# Altium project Odrive_M.PrjPcb (part 2 of 2)

## Sheet DRV8301_Power.SchDoc
size A3; SheetNumber: 2; SheetTotal: 4
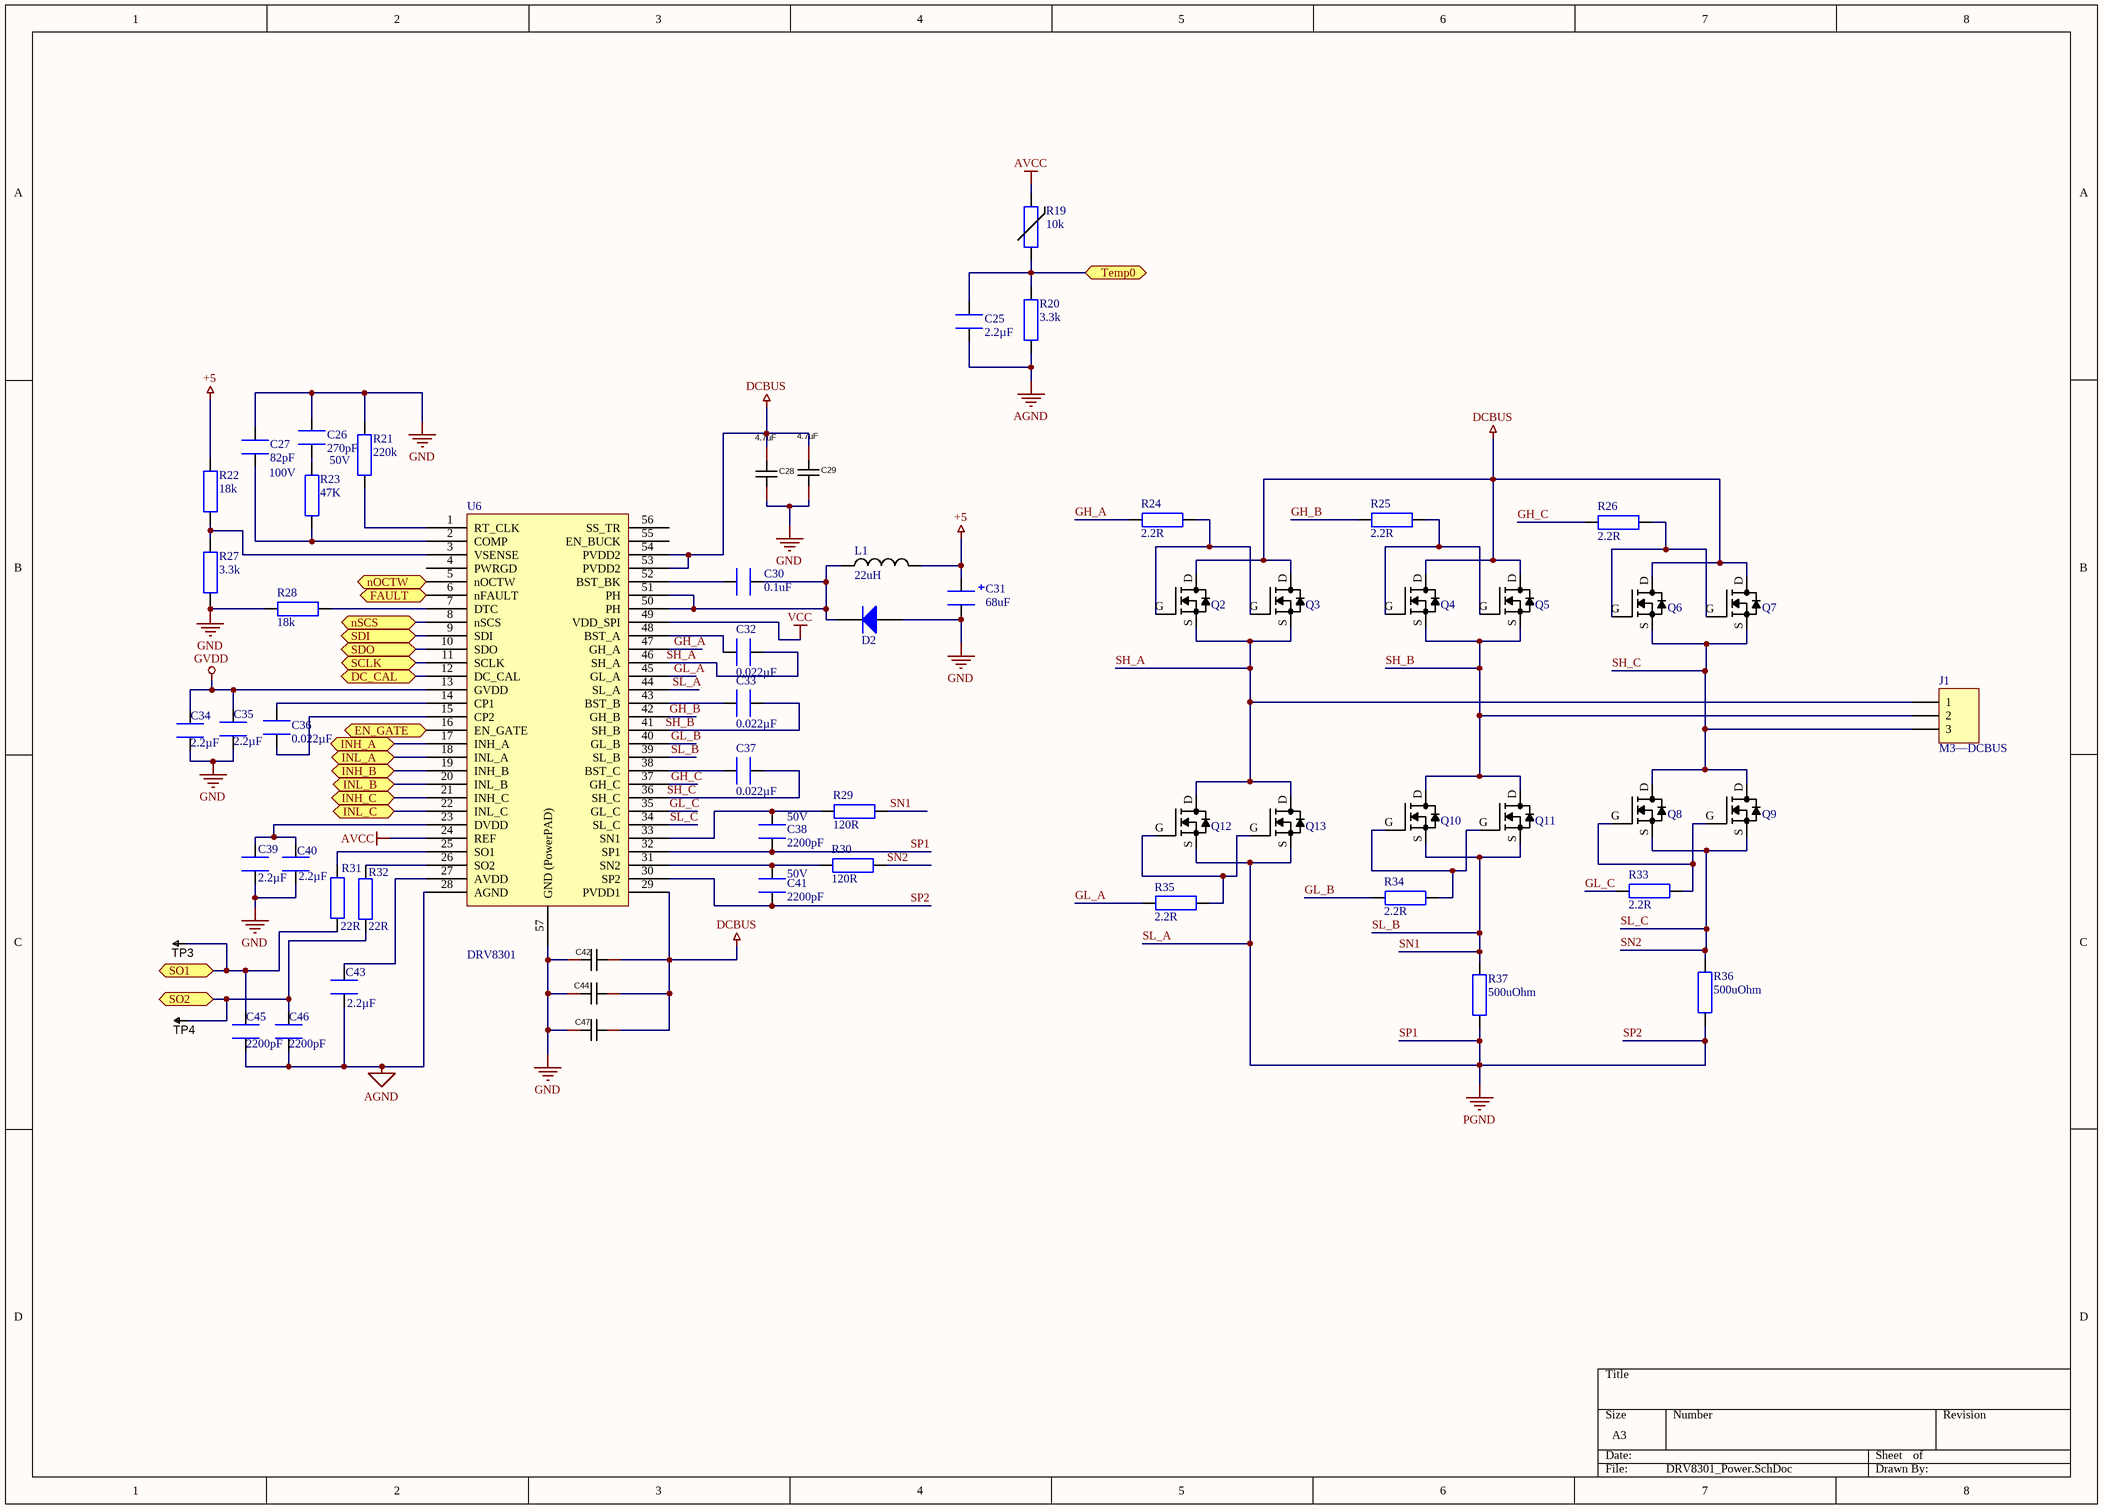
[diagram p2: DRV8301_Power.SchDoc]

### Parts
C25  2.2µF  [CAPC1608X09L]
C26  270pF  Voltage - Rated: 50V  [CAPC1608X09L]
C27  82pF  Voltage - Rated: 100V  [CAPC1608X09L]
C28  4.7uF  [C1210]
C29  4.7uF  [C1210]
C30  0.1uF  [CAPC1608X09L]
C31  68uF  [CAPCP6032X28N]
C32  0.022µF  [CAPC1608X09L]
C33  0.022µF  [CAPC1608X09L]
C34  2.2µF  [CAPC1608X09L]
C35  2.2µF  [CAPC1608X09L]
C36  0.022µF  [CAPC1608X09L]
C37  0.022µF  [CAPC1608X09L]
C38  2200pF  Voltage - Rated: 50V  [CAPC1608X09L]
C39  2.2µF  [CAPC1608X09L]
C40  2.2µF  [CAPC1608X09L]
C41  2200pF  Voltage - Rated: 50V  [CAPC1608X09L]
C42  4.7uF  [C1210]  (value not drawn)
C43  2.2µF  [CAPC1608X09L]
C44  4.7uF  [C1210]  (value not drawn)
C45  2200pF  [CAPC1608X09L]
C46  2200pF  [CAPC1608X09L]
C47  4.7uF  [C1210]  (value not drawn)
D2  MBR140SFT1G  [DIOM2717X10N]  (value not drawn)
J1  M3—DCBUS  [CONN-TH_MR30-M]
L1  22uH  [INDC6060X28N]
Q2  NTMFS5C628NLT  [SO8FL]  (value not drawn)
Q3  NTMFS5C628NLT  [SO8FL]  (value not drawn)
Q4  NTMFS5C628NLT  [SO8FL]  (value not drawn)
Q5  NTMFS5C628NLT  [SO8FL]  (value not drawn)
Q6  NTMFS5C628NLT  [SO8FL]  (value not drawn)
Q7  NTMFS5C628NLT  [SO8FL]  (value not drawn)
Q8  NTMFS5C628NLT  [SO8FL]  (value not drawn)
Q9  NTMFS5C628NLT  [SO8FL]  (value not drawn)
Q10  NTMFS5C628NLT  [SO8FL]  (value not drawn)
Q11  NTMFS5C628NLT  [SO8FL]  (value not drawn)
Q12  NTMFS5C628NLT  [SO8FL]  (value not drawn)
Q13  NTMFS5C628NLT  [SO8FL]  (value not drawn)
R19  value 10k  [RESC1005X40N]  (hidden comment: NCP15XH103F03RC)
R20  3.3k  [RESC1608X55N]
R21  220k  [RESC1608X55N]
R22  18k  [0603_R]
R23  47K  [RESC1608X55N]
R24  2.2R  [RESC1608X55N]
R25  2.2R  [RESC1608X55N]
R26  2.2R  [RESC1608X55N]
R27  3.3k  [0603_R]
R28  18k  [0603_R]
R29  120R  [RESC1608X55N]
R30  120R  [RESC1608X55N]
R31  22R  [RESC1608X55N]
R32  22R  [RESC1608X55N]
R33  2.2R  [RESC1608X55N]
R34  2.2R  [RESC1608X55N]
R35  2.2R  [RESC1608X55N]
R36  value 500uOhm  [RESC6432X09N]  (hidden comment: CSR2512C0R0005F)
R37  value 500uOhm  [RESC6432X09N]  (hidden comment: CSR2512C0R0005F)
TP3  TESTPOINT  [TP-R30]  (value not drawn)  (no BOM)
TP4  TESTPOINT  [TP-R30]  (value not drawn)  (no BOM)
U6  DRV8301  [TSSOP50P810X120_HS-57N]

### Ports
DC_CAL (bidir), EN_GATE (bidir), FAULT (bidir), INH_A (bidir), INH_B (bidir), INH_C (bidir), INL_A (bidir), INL_B (bidir), INL_C (bidir), nOCTW (bidir), nSCS (bidir), SCLK (bidir), SDI (bidir), SDO (bidir), SO1 (bidir), SO2 (bidir), Temp0 (bidir)

### Nets
+5: C31.1 L1.2 R22.2
AGND: C25.1 C26.2 C27.2 C28.1 C29.1 C31.2 C34.1 C35.1 C39.2 C40.2 C42.1 C43.1 C44.1 C45.1 C46.1 C47.1 D2.A R20.1 R21.2 R27.1 R28.2 U6.28(AGND) U6.57(GND_(PowerPAD))  [also labelled GND]
AVCC: R19.2 U6.24(REF)
DCBUS: C28.2 C29.2 C42.2 C44.2 C47.2 Q2.D Q3.D Q4.D Q5.D Q6.D Q7.D U6.29(PVDD1) U6.53(PVDD2) U6.54(PVDD2)
GVDD: C34.2 C35.2 U6.13(GVDD)
PGND: C38.1 C41.1 Q12.S Q13.S R36.1 R37.1 U6.30(SP2) U6.32(SP1) U6.44(SL_A)  [also labelled SL_A, SP1, SP2]
VCC: U6.49(VDD_SPI)
EN_GATE: U6.16(EN_GATE) ; port EN_GATE
FAULT: U6.6(nFAULT) ; port FAULT
GH_A: R24.2 U6.47(GH_A)  [project net GH_A_2]
GH_B: R25.2 U6.42(GH_B)  [project net GH_B_2]
GH_C: R26.2 U6.37(GH_C)  [project net GH_C_2]
GL_A: R35.2 U6.45(GL_A)  [project net GL_A_2]
GL_B: R34.2 U6.40(GL_B)  [project net GL_B_2]
GL_C: R33.2 U6.35(GL_C)  [project net GL_C_2]
M0_AH: U6.17(INH_A) ; port INH_A
M0_AL: U6.18(INL_A) ; port INL_A
M0_BH: U6.19(INH_B) ; port INH_B
M0_BL: U6.20(INL_B) ; port INL_B
M0_CH: U6.21(INH_C) ; port INH_C
M0_CL: U6.22(INL_C) ; port INL_C
M0_nCS: U6.8(nSCS) ; port nSCS
M0_SO1: C45.2 R31.2 TP3.1 ; port SO1
M0_SO2: C46.2 R32.2 TP4.1 ; port SO2
M0_TEMP: C25.2 R19.1 R20.2 ; port Temp0
OCTW: U6.5(nOCTW) ; port nOCTW
SH_A: C32.1 J1.1 Q2.S Q3.S Q12.D Q13.D U6.46(SH_A)  [project net SH_A_2]
SH_B: C33.1 J1.2 Q4.S Q5.S Q10.D Q11.D U6.41(SH_B)  [project net SH_B_2]
SH_C: C37.1 J1.3 Q6.S Q7.S Q8.D Q9.D U6.36(SH_C)  [project net SH_C_2]
SL_B: Q10.S Q11.S R29.1 R37.2 U6.39(SL_B)  [also labelled SN1]  [project net SL_B_2]
SL_C: Q8.S Q9.S R30.1 R36.2 U6.34(SL_C)  [also labelled SN2]  [project net SL_C_2]
SPI_MISO: U6.9(SDI) ; port SDI
SPI_MOSI: U6.10(SDO) ; port SDO
SPI_SCK: U6.11(SCLK) ; port SCLK
NetC26_1: C26.1 R23.1
NetC27_1: C27.1 R23.2 U6.2(COMP)
NetC30_1: C30.1 D2.K L1.1 U6.50(PH) U6.51(PH)
NetC30_2: C30.2 U6.52(BST_BK)
NetC32_2: C32.2 U6.48(BST_A)
NetC33_2: C33.2 U6.43(BST_B)
NetC36_1: C36.1 U6.14(CP1)
NetC36_2: C36.2 U6.15(CP2)
NetC37_2: C37.2 U6.38(BST_C)
NetC38_2: C38.2 R29.2 U6.33(SN1)
NetC39_1: C39.1 C40.1 U6.23(DVDD)
NetC41_2: C41.2 R30.2 U6.31(SN2)
NetC43_2: C43.2 U6.27(AVDD)
NetQ2_G: Q2.G Q3.G R24.1
NetQ4_G: Q4.G Q5.G R25.1
NetQ6_G: Q6.G Q7.G R26.1
NetQ8_G: Q8.G Q9.G R33.1
NetQ10_G: Q10.G Q11.G R34.1
NetQ12_G: Q12.G Q13.G R35.1
NetR21_1: R21.1 U6.1(RT_CLK)
NetR22_1: R22.1 R27.2 U6.3(VSENSE)
NetR28_1: R28.1 U6.7(DTC)
NetR31_1: R31.1 U6.25(SO1)
NetR32_1: R32.1 U6.26(SO2)
NetU6_12: U6.12(DC_CAL) ; port DC_CAL

Not connected (* = marked no-connect by the designer): U6 4(PWRGD) 55(EN_BUCK) 56(SS_TR)

### Library data of the parts
C25 C34 C35 C39 C40 C43 = GRM188R61C225KE15D: CAP CER 2.2UF 16V X5R 0603; Manufacturer: Murata Electronics North America; Tolerance: ±10%; Supplier 1: Digi-Key; Supplier Part Number 1: 490-3296-1-ND; Manufacturer Part Number: GRM188R61C225KE15D; RoHS: RoHS Compliant; Category: Capacitors; Stock 1: 1255740; Pricing 1: 1=0.12, 10=0.08, 50=0.046, 100=0.038, 250=0.032, 500=0.0268, 1000=0.022 (USD); Packaging: Cut Tape (CT); Capacitance: 2.2µF; Voltage - Rated: 16V; Temperature Coefficient: X5R; Mounting Type: Surface Mount, MLCC; Operating Temperature: -55°C ~ 85°C; Applications: General Purpose; Ratings: -; Package / Case: 0603 (1608 Metric); Size / Dimension: 0.063" L x 0.031" W (1.60mm x 0.80mm); Height - Seated (Max): -; Thickness (Max): 0.035" (0.90mm); Lead Spacing: -; Features: -; Lead Style: -; ComponentLink1URL: http://www.murata.com/~/media/webrenewal/support/library/catalog/products/capacitor/mlcc/c02e.pdf; ComponentLink1Description: http://www.murata.com/~/media/webrenewal/support/library/catalog/products/capacitor/mlcc/c02e.pdf
C26 = GRM1885C1H271JA01D: CAP CER 270PF 50V NP0 0603; Manufacturer: Murata Electronics North America; Tolerance: ±5%; Temperature Coefficient: C0G, NP0; Supplier 1: Digi-Key; Supplier Part Number 1: 490-1437-1-ND; Manufacturer Part Number: GRM1885C1H271JA01D; RoHS: RoHS Compliant; Category: Capacitors; Stock 1: 46048; Pricing 1: 1=0.1, 10=0.048, 50=0.026, 100=0.022, 250=0.018, 500=0.0154, 1000=0.012 (USD); Packaging: Cut Tape (CT); Capacitance: 270pF; Mounting Type: Surface Mount, MLCC; Operating Temperature: -55°C ~ 125°C; Applications: General Purpose; Ratings: -; Package / Case: 0603 (1608 Metric); Size / Dimension: 0.063" L x 0.031" W (1.60mm x 0.80mm); Height - Seated (Max): -; Thickness (Max): 0.035" (0.90mm); Lead Spacing: -; Features: -; Lead Style: -; ComponentLink1URL: http://www.murata.com/~/media/webrenewal/support/library/catalog/products/capacitor/mlcc/c02e.pdf; ComponentLink1Description: http://www.murata.com/~/media/webrenewal/support/library/catalog/products/capacitor/mlcc/c02e.pdf
C27 = GRM1885C2A820JA01D: CAP CER 82PF 100V NP0 0603; Manufacturer: Murata Electronics North America; Tolerance: ±5%; Temperature Coefficient: C0G, NP0; Supplier 1: Digi-Key; Supplier Part Number 1: 490-1349-1-ND; Manufacturer Part Number: GRM1885C2A820JA01D; RoHS: RoHS Compliant; Category: Capacitors; Stock 1: 58970; Pricing 1: 1=0.1, 10=0.052, 50=0.028, 100=0.0237, 250=0.01936, 500=0.01656, 1000=0.0129 (USD); Packaging: Cut Tape (CT); Capacitance: 82pF; Mounting Type: Surface Mount, MLCC; Operating Temperature: -55°C ~ 125°C; Applications: General Purpose; Ratings: -; Package / Case: 0603 (1608 Metric); Size / Dimension: 0.063" L x 0.031" W (1.60mm x 0.80mm); Height - Seated (Max): -; Thickness (Max): 0.035" (0.90mm); Lead Spacing: -; Features: -; Lead Style: -; ComponentLink1URL: http://www.murata.com/~/media/webrenewal/support/library/catalog/products/capacitor/mlcc/c02e.pdf; ComponentLink1Description: http://www.murata.com/~/media/webrenewal/support/library/catalog/products/capacitor/mlcc/c02e.pdf
C28 C29 C42 C44 C47 = C1210X7R475K630NT: 4.7uF 63V 1210封装; Manufacturer: SANYEAR(叁叶源); Add into BOM: yes; Temperature Coefficient: X7R; Name: 4.7uF; Symbol: C1210X7R475K630NT; Device: C1210X7R475K630NT; Manufacturer Part: C1210X7R475K630NT; Value: 4.7uF; Supplier Part: C2911397; Supplier Footprint: 1210; JLCPCB Part Class: Extended Part; Datasheet: https://atta.szlcsc.com/upload/public/pdf/source/20210902/8F39E0658D363F48630A7672568BDC14.pdf; Supplier: LCSC; Convert to PCB: yes; LCSC Part Name: 4.7uF 63V; Voltage Rated: 63V
C30 = GRM188R71H104KA93D: CAP CER 0.1UF 50V X7R 0603; Manufacturer: Murata Electronics North America; Tolerance: ±10%; Supplier 1: Digi-Key; Supplier Part Number 1: 490-1519-2-ND; Manufacturer Part Number: GRM188R71H104KA93D; RoHS: RoHS Compliant; Category: Capacitors; Pricing 1: 4000=0.01822, 8000=0.01663, 12000=0.01584 (USD); Packaging: Tape & Reel (TR); Capacitance: 0.1uF; Voltage - Rated: 50V; Temperature Coefficient: X7R; Mounting Type: Surface Mount, MLCC; Operating Temperature: -55°C ~ 125°C; Applications: General Purpose; Ratings: -; Package / Case: 0603 (1608 Metric); Size / Dimension: 0.063" L x 0.032" W (1.60mm x 0.80mm); Height - Seated (Max): -; Thickness (Max): 0.035" (0.90mm); Lead Spacing: -; Features: -; Lead Style: -; ComponentLink1URL: http://www.murata.com/~/media/webrenewal/support/library/catalog/products/capacitor/mlcc/c02e.ashx?la=en-us; ComponentLink1Description: http://www.murata.com/~/media/webrenewal/support/library/catalog/products/capacitor/mlcc/c02e.ashx?la=en-us; Stock: 19812000; Part Status: Active; Supplier 2: Digi-Key; Supplier Part Number 2: 490-1519-1-ND; Pricing 2: 1=0.12, 10=0.084, 100=0.0396, 500=0.02778, 1000=0.023 (USD)
C31 = T495C686M016ATE250: CAP TANT 68UF 16V 20% 2312 250mOhm; Manufacturer: KEMET; Manufacturer Size Code: C; Type: Molded; Lifetime @ Temp.: 2000 Hrs @ 85°C; Value: 68uF; Supplier 1: Digi-Key; Supplier Part Number 1: 399-10452-1-ND; RoHS: RoHS Compliant; Category: Capacitors; Stock: 39507; Pricing 1: 1=0.98, 10=0.747, 100=0.5345 (USD); Packaging: Cut Tape (CT); Part Status: Active; Tolerance: ±20%; ESR (Equivalent Series Resistance): 250 mOhm; Operating Temperature: -55°C ~ 125°C; Mounting Type: Surface Mount; Package / Case: 2312 (6032 Metric); Size / Dimension: 0.236" L x 0.126" W (6.00mm x 3.20mm); Height - Seated (Max): 0.110" (2.80mm); Lead Spacing: -; Features: General Purpose; Failure Rate: -; ComponentLink1URL: https://search.kemet.com/component-edge/download/datasheet/T495C686M016ATE250.pdf; ComponentLink1Description: https://search.kemet.com/component-edge/download/datasheet/T495C686M016ATE250.pdf; Supplier 2: Digi-Key; Supplier Part Number 2: 399-10452-2-ND; Pricing 2: 500=0.35986, 1000=0.30988, 2500=0.28988, 5000=0.27608 (USD); Manufacturer Part Number: T495C686M016ATE250
C32 C33 C36 C37 = GRM188R71H223KA01D: CAP CER 0.022UF 50V X7R 0603; Manufacturer: Murata Electronics North America; Tolerance: ±10%; Supplier 1: Digi-Key; Supplier Part Number 1: 490-1517-2-ND; Manufacturer Part Number: GRM188R71H223KA01D; RoHS: RoHS Compliant; Category: Capacitors; Pricing 1: 4000=0.01518, 8000=0.01386, 12000=0.0132 (USD); Packaging: Tape & Reel (TR); Capacitance: 0.022µF; Voltage - Rated: 50V; Temperature Coefficient: X7R; Mounting Type: Surface Mount, MLCC; Operating Temperature: -55°C ~ 125°C; Applications: General Purpose; Ratings: -; Package / Case: 0603 (1608 Metric); Size / Dimension: 0.063" L x 0.032" W (1.60mm x 0.80mm); Height - Seated (Max): -; Thickness (Max): 0.035" (0.90mm); Lead Spacing: -; Features: -; Lead Style: -; ComponentLink1URL: http://search.murata.co.jp/Ceramy/image/img/A01X/G101/ENG/GRM188R71H223KA01-01.pdf; ComponentLink1Description: http://search.murata.co.jp/Ceramy/image/img/A01X/G101/ENG/GRM188R71H223KA01-01.pdf; Stock: 608000; Part Status: Active; Supplier 2: Digi-Key; Supplier Part Number 2: 490-1517-1-ND; Pricing 2: 1=0.11, 10=0.083, 100=0.0372, 500=0.02656, 1000=0.02087 (USD)
C38 C41 C45 C46 = GRM1885C1H222JA01D: CAP CER 2200PF 50V NP0 0603; Manufacturer: Murata Electronics North America; Tolerance: ±5%; Temperature Coefficient: C0G, NP0; Supplier 1: Digi-Key; Supplier Part Number 1: 490-1459-1-ND; RoHS: RoHS Compliant; Category: Capacitors; Stock 1: 850589; Pricing 1: 1=0.11, 10=0.08, 25=0.058, 50=0.0434, 100=0.0355, 250=0.02972, 500=0.02536, 1000=0.01992 (USD); Packaging: Cut Tape (CT); Capacitance: 2200pF; Mounting Type: Surface Mount, MLCC; Operating Temperature: -55°C ~ 125°C; Applications: General Purpose; Ratings: -; Package / Case: 0603 (1608 Metric); Size / Dimension: 0.063" L x 0.031" W (1.60mm x 0.80mm); Height - Seated (Max): -; Thickness (Max): 0.035" (0.90mm); Lead Spacing: -; Features: -; Lead Style: -; ComponentLink1URL: http://www.murata.com/~/media/webrenewal/support/library/catalog/products/capacitor/mlcc/c02e.ashx; ComponentLink1Description: http://www.murata.com/~/media/webrenewal/support/library/catalog/products/capacitor/mlcc/c02e.ashx; Part Status: Active
  C45 C46: Voltage - Rated: 50V
D2 = MBR140SFT1G: Rectifier Diode, Single, 40 V, 1 A, SOD-123FL, 2, 550 mV
J1 = Header 3: Header, 3-Pin; LatestRevisionDate: 17-Jul-2002; LatestRevisionNote: Re-released for DXP Platform.; Publisher: Altium Limited
L1 = NR6028T220M: INDUCTOR 22UH 1.4A 175.5 MOHM; Value: 22uH
Q2-Q13 = NTMFS5C628NLT: MOSFET N-CH 60V SO8FL; Manufacturer: ON Semiconductor; Manufacturer Part Number: NTMFS5C628NLT1G; FET Type: N-Channel; Drive Voltage (Max Rds On,  Min Rds On): 4.5V, 10V; Vgs(th) (Max) @ Id: 2V @ 135µA; Gate Charge (Qg) (Max) @ Vgs: 52nC @ 10V; Input Capacitance (Ciss) (Max) @ Vds: 3600pF @ 25V; Vgs (Max): ±20V; Power Dissipation (Max): 3.7W (Ta), 110W (Tc); Rds On (Max) @ Id, Vgs: 2.4 mOhm @ 50A, 10V; Supplier 1: Digi-Key; Supplier Part Number 1: NTMFS5C628NLT1GOSCT-ND; RoHS: RoHS Compliant; Category: Discrete Semiconductor Products; Stock: 1490; Pricing 1: 1=1.8, 10=1.627, 100=1.3078, 500=1.01716 (USD); Packaging: Cut Tape (CT); Part Status: Active; Technology: MOSFET (Metal Oxide); Current - Continuous Drain (Id) @ 25°C: -; FET Feature: -; Operating Temperature: -55°C ~ 175°C (TJ); Mounting Type: Surface Mount; Supplier Device Package: 5-DFN (5x6) (8-SOFL); Package / Case: 8-PowerTDFN; ComponentLink1URL: http://www.onsemi.com/pub/Collateral/NTMFS5C628NL-D.PDF; ComponentLink1Description: http://www.onsemi.com/pub/Collateral/NTMFS5C628NL-D.PDF; Supplier 2: Digi-Key; Supplier Part Number 2: NTMFS5C628NLT1GOSTR-ND; Pricing 2: 1500=0.81823 (USD)
R19 = NCP15XH103F03RC: THERMISTOR 10K OHM NTC 0402 SMD
R20 R27 = RC0603FR-073K3L: RES SMD 3.3K OHM 1% 1/10W 0603; Manufacturer: Yageo; Power (Watts): 0.1W, 1/10W; Temperature Coefficient: ±100ppm/°C; Supplier 1: Digi-Key; Supplier Part Number 1: 311-3.30KHRCT-ND; Manufacturer Part Number: RC0603FR-073K3L; RoHS: RoHS Compliant; Category: Resistors; Stock 1: 420019; Pricing 1: 1=0.1, 10=0.014, 25=0.01, 100=0.0057, 250=0.00436, 500=0.00348, 1000=0.00257, 2500=0.00223 (USD); Packaging: Cut Tape (CT); Resistance (Ohms): 3.3k; Tolerance: ±1%; Composition: Thick Film; Features: Moisture Resistant; Operating Temperature: -55°C ~ 155°C; Package / Case: 0603 (1608 Metric); Supplier Device Package: 0603; Size / Dimension: 0.063" L x 0.031" W (1.60mm x 0.80mm); Height: 0.022" (0.55mm); Number of Terminations: 2; ComponentLink1URL: http://www.yageo.com/documents/recent/PYu-RC_Group_51_RoHS_L_04.pdf; ComponentLink1Description: http://www.yageo.com/documents/recent/PYu-RC_Group_51_RoHS_L_04.pdf
R21 = RC0603FR-07220KL: RES SMD 220K OHM 1% 1/10W 0603; Manufacturer: Yageo; Power (Watts): 0.1W, 1/10W; Temperature Coefficient: ±100ppm/°C; Supplier 1: Digi-Key; Supplier Part Number 1: 311-220KHRCT-ND; Manufacturer Part Number: RC0603FR-07220KL; RoHS: RoHS Compliant; Category: Resistors; Stock 1: 204390; Pricing 1: 1=0.1, 10=0.014, 25=0.01, 100=0.0057, 250=0.00436, 500=0.00348, 1000=0.00257, 2500=0.00223 (USD); Packaging: Cut Tape (CT); Resistance (Ohms): 220k; Tolerance: ±1%; Composition: Thick Film; Features: Moisture Resistant; Operating Temperature: -55°C ~ 155°C; Package / Case: 0603 (1608 Metric); Supplier Device Package: 0603; Size / Dimension: 0.063" L x 0.031" W (1.60mm x 0.80mm); Height: 0.022" (0.55mm); Number of Terminations: 2; ComponentLink1URL: http://www.yageo.com/documents/recent/PYu-RC_Group_51_RoHS_L_04.pdf; ComponentLink1Description: http://www.yageo.com/documents/recent/PYu-RC_Group_51_RoHS_L_04.pdf
R22 R28 = RC0603FR-0718KL: RES SMD 18K OHM 1% 1/10W 0603; Manufacturer: Yageo; Power (Watts): 0.1W, 1/10W; Temperature Coefficient: ±100ppm/°C; Supplier 1: Digi-Key; Supplier Part Number 1: 311-18.0KHRCT-ND; Manufacturer Part Number: RC0603FR-0718KL; RoHS: RoHS Compliant; Category: Resistors; Stock 1: 0; Pricing 1: 1=0.1, 10=0.014, 25=0.01, 100=0.0057, 250=0.00436, 500=0.00348, 1000=0.00257, 2500=0.00223 (USD); Packaging: Cut Tape (CT); Resistance (Ohms): 18k; Tolerance: ±1%; Composition: Thick Film; Features: Moisture Resistant; Operating Temperature: -55°C ~ 155°C; Package / Case: 0603 (1608 Metric); Supplier Device Package: 0603; Size / Dimension: 0.063" L x 0.031" W (1.60mm x 0.80mm); Height: 0.022" (0.55mm); Number of Terminations: 2; ComponentLink1URL: http://www.yageo.com/documents/recent/PYu-RC_Group_51_RoHS_L_04.pdf; ComponentLink1Description: http://www.yageo.com/documents/recent/PYu-RC_Group_51_RoHS_L_04.pdf
R23 = RC0603FR-0747KL: RES SMD 47K OHM 1% 1/10W 0603; Manufacturer: Yageo; Power (Watts): 0.1W, 1/10W; Temperature Coefficient: ±100ppm/°C; Supplier 1: Digi-Key; Supplier Part Number 1: 311-47.0KHRCT-ND; Manufacturer Part Number: RC0603FR-0747KL; RoHS: RoHS Compliant; Category: Resistors; Stock 1: 930868; Pricing 1: 1=0.1, 10=0.014, 25=0.01, 100=0.0057, 250=0.00436, 500=0.00348, 1000=0.00257, 2500=0.00223 (USD); Packaging: Cut Tape (CT); Resistance (Ohms): 47k; Tolerance: ±1%; Composition: Thick Film; Features: Moisture Resistant; Operating Temperature: -55°C ~ 155°C; Package / Case: 0603 (1608 Metric); Supplier Device Package: 0603; Size / Dimension: 0.063" L x 0.031" W (1.60mm x 0.80mm); Height: 0.022" (0.55mm); Number of Terminations: 2; ComponentLink1URL: http://www.yageo.com/documents/recent/PYu-RC_Group_51_RoHS_L_04.pdf; ComponentLink1Description: http://www.yageo.com/documents/recent/PYu-RC_Group_51_RoHS_L_04.pdf
R24-R26 R33-R35 = RC0603FR-072R2L: RES SMD 2.2 OHM 1% 1/10W 0603; Manufacturer: Yageo; Resistance (Ohms): 2.2; Power (Watts): 0.1W, 1/10W; Temperature Coefficient: ±200ppm/°C; Supplier 1: Digi-Key; Supplier Part Number 1: 311-2.2HRCT-ND; Manufacturer Part Number: RC0603FR-072R2L; RoHS: RoHS Compliant; Category: Resistors; Stock 1: 16531; Pricing 1: 1=0.1, 10=0.02, 25=0.0144, 100=0.0082, 250=0.00624, 500=0.00498, 1000=0.00367, 2500=0.00319 (USD); Packaging: Cut Tape (CT); Tolerance: ±1%; Composition: Thick Film; Features: Moisture Resistant; Operating Temperature: -55°C ~ 155°C; Package / Case: 0603 (1608 Metric); Supplier Device Package: 0603; Size / Dimension: 0.063" L x 0.031" W (1.60mm x 0.80mm); Height: 0.022" (0.55mm); Number of Terminations: 2; ComponentLink1URL: http://www.yageo.com/documents/recent/PYu-RC_Group_51_RoHS_L_04.pdf; ComponentLink1Description: http://www.yageo.com/documents/recent/PYu-RC_Group_51_RoHS_L_04.pdf
R29 R30 = RC0603FR-07120RL: RES SMD 120 OHM 1% 1/10W 0603; Manufacturer: Yageo; Resistance (Ohms): 120; Power (Watts): 0.1W, 1/10W; Temperature Coefficient: ±100ppm/°C; Supplier 1: Digi-Key; Supplier Part Number 1: 311-120HRCT-ND; Manufacturer Part Number: RC0603FR-07120RL; RoHS: RoHS Compliant; Category: Resistors; Stock 1: 1545282; Pricing 1: 1=0.1, 10=0.014, 25=0.01, 100=0.0057, 250=0.00436, 500=0.00348, 1000=0.00257, 2500=0.00223 (USD); Packaging: Cut Tape (CT); Tolerance: ±1%; Composition: Thick Film; Features: Moisture Resistant; Operating Temperature: -55°C ~ 155°C; Package / Case: 0603 (1608 Metric); Supplier Device Package: 0603; Size / Dimension: 0.063" L x 0.031" W (1.60mm x 0.80mm); Height: 0.022" (0.55mm); Number of Terminations: 2; ComponentLink1URL: http://www.yageo.com/documents/recent/PYu-RC_Group_51_RoHS_L_04.pdf; ComponentLink1Description: http://www.yageo.com/documents/recent/PYu-RC_Group_51_RoHS_L_04.pdf
R31 R32 = RC0603FR-0722RL: RES SMD 22 OHM 1% 1/10W 0603; Manufacturer: Yageo; Resistance (Ohms): 22; Power (Watts): 0.1W, 1/10W; Temperature Coefficient: ±100ppm/°C; Supplier 1: Digi-Key; Supplier Part Number 1: 311-22.0HRCT-ND; Manufacturer Part Number: RC0603FR-0722RL; RoHS: RoHS Compliant; Category: Resistors; Stock 1: 575303; Pricing 1: 1=0.1, 10=0.014, 25=0.01, 100=0.0057, 250=0.00436, 500=0.00348, 1000=0.00257, 2500=0.00223 (USD); Packaging: Cut Tape (CT); Tolerance: ±1%; Composition: Thick Film; Features: Moisture Resistant; Operating Temperature: -55°C ~ 155°C; Package / Case: 0603 (1608 Metric); Supplier Device Package: 0603; Size / Dimension: 0.063" L x 0.031" W (1.60mm x 0.80mm); Height: 0.022" (0.55mm); Number of Terminations: 2; ComponentLink1URL: http://www.yageo.com/documents/recent/PYu-RC_Group_51_RoHS_L_04.pdf; ComponentLink1Description: http://www.yageo.com/documents/recent/PYu-RC_Group_51_RoHS_L_04.pdf
R36 R37 = CSR2512C0R0005F: RES SMD 0.0005 OHM 1% 3W 2512; Manufacturer: Riedon; Temperature Coefficient: ±100ppm/°C; Supplier 1: Digi-Key; Supplier Part Number 1: 696-1183-2-ND; RoHS: RoHS Compliant; Category: Resistors; Stock: 2000; Pricing 1: 2000=0.19817, 6000=0.1937, 10000=0.187, 50000=0.18148 (USD); Packaging: Tape & Reel (TR); Part Status: Active; Tolerance: ±1%; Power (Watts): 3W; Composition: Metal Element; Features: Current Sense; Operating Temperature: -55°C ~ 170°C; Package / Case: 2512 (6432 Metric); Supplier Device Package: 2512; Size / Dimension: 0.250" L x 0.118" W (6.35mm x 3.00mm); Height - Seated (Max): 0.057" (1.45mm); Failure Rate: -; ComponentLink1URL: http://riedon.com/media/pdf/CSR.pdf; ComponentLink1Description: http://riedon.com/media/pdf/CSR.pdf; Supplier 2: Digi-Key; Supplier Part Number 2: 696-1183-1-ND; Pricing 2: 1=0.69, 10=0.574, 25=0.4916, 50=0.4426, 100=0.3852, 250=0.3442, 500=0.27864, 1000=0.22536 (USD); Manufacturer Part Number: CSR2512C0R0005F
TP3 TP4 = TESTPOINT: SMD test pin
U6 = DRV8301: MOTOR DRIVER, 3PH, 56HTSSOP

## Sheet DRV8301_NoPower.SchDoc
size A3; SheetNumber: 3; SheetTotal: 4
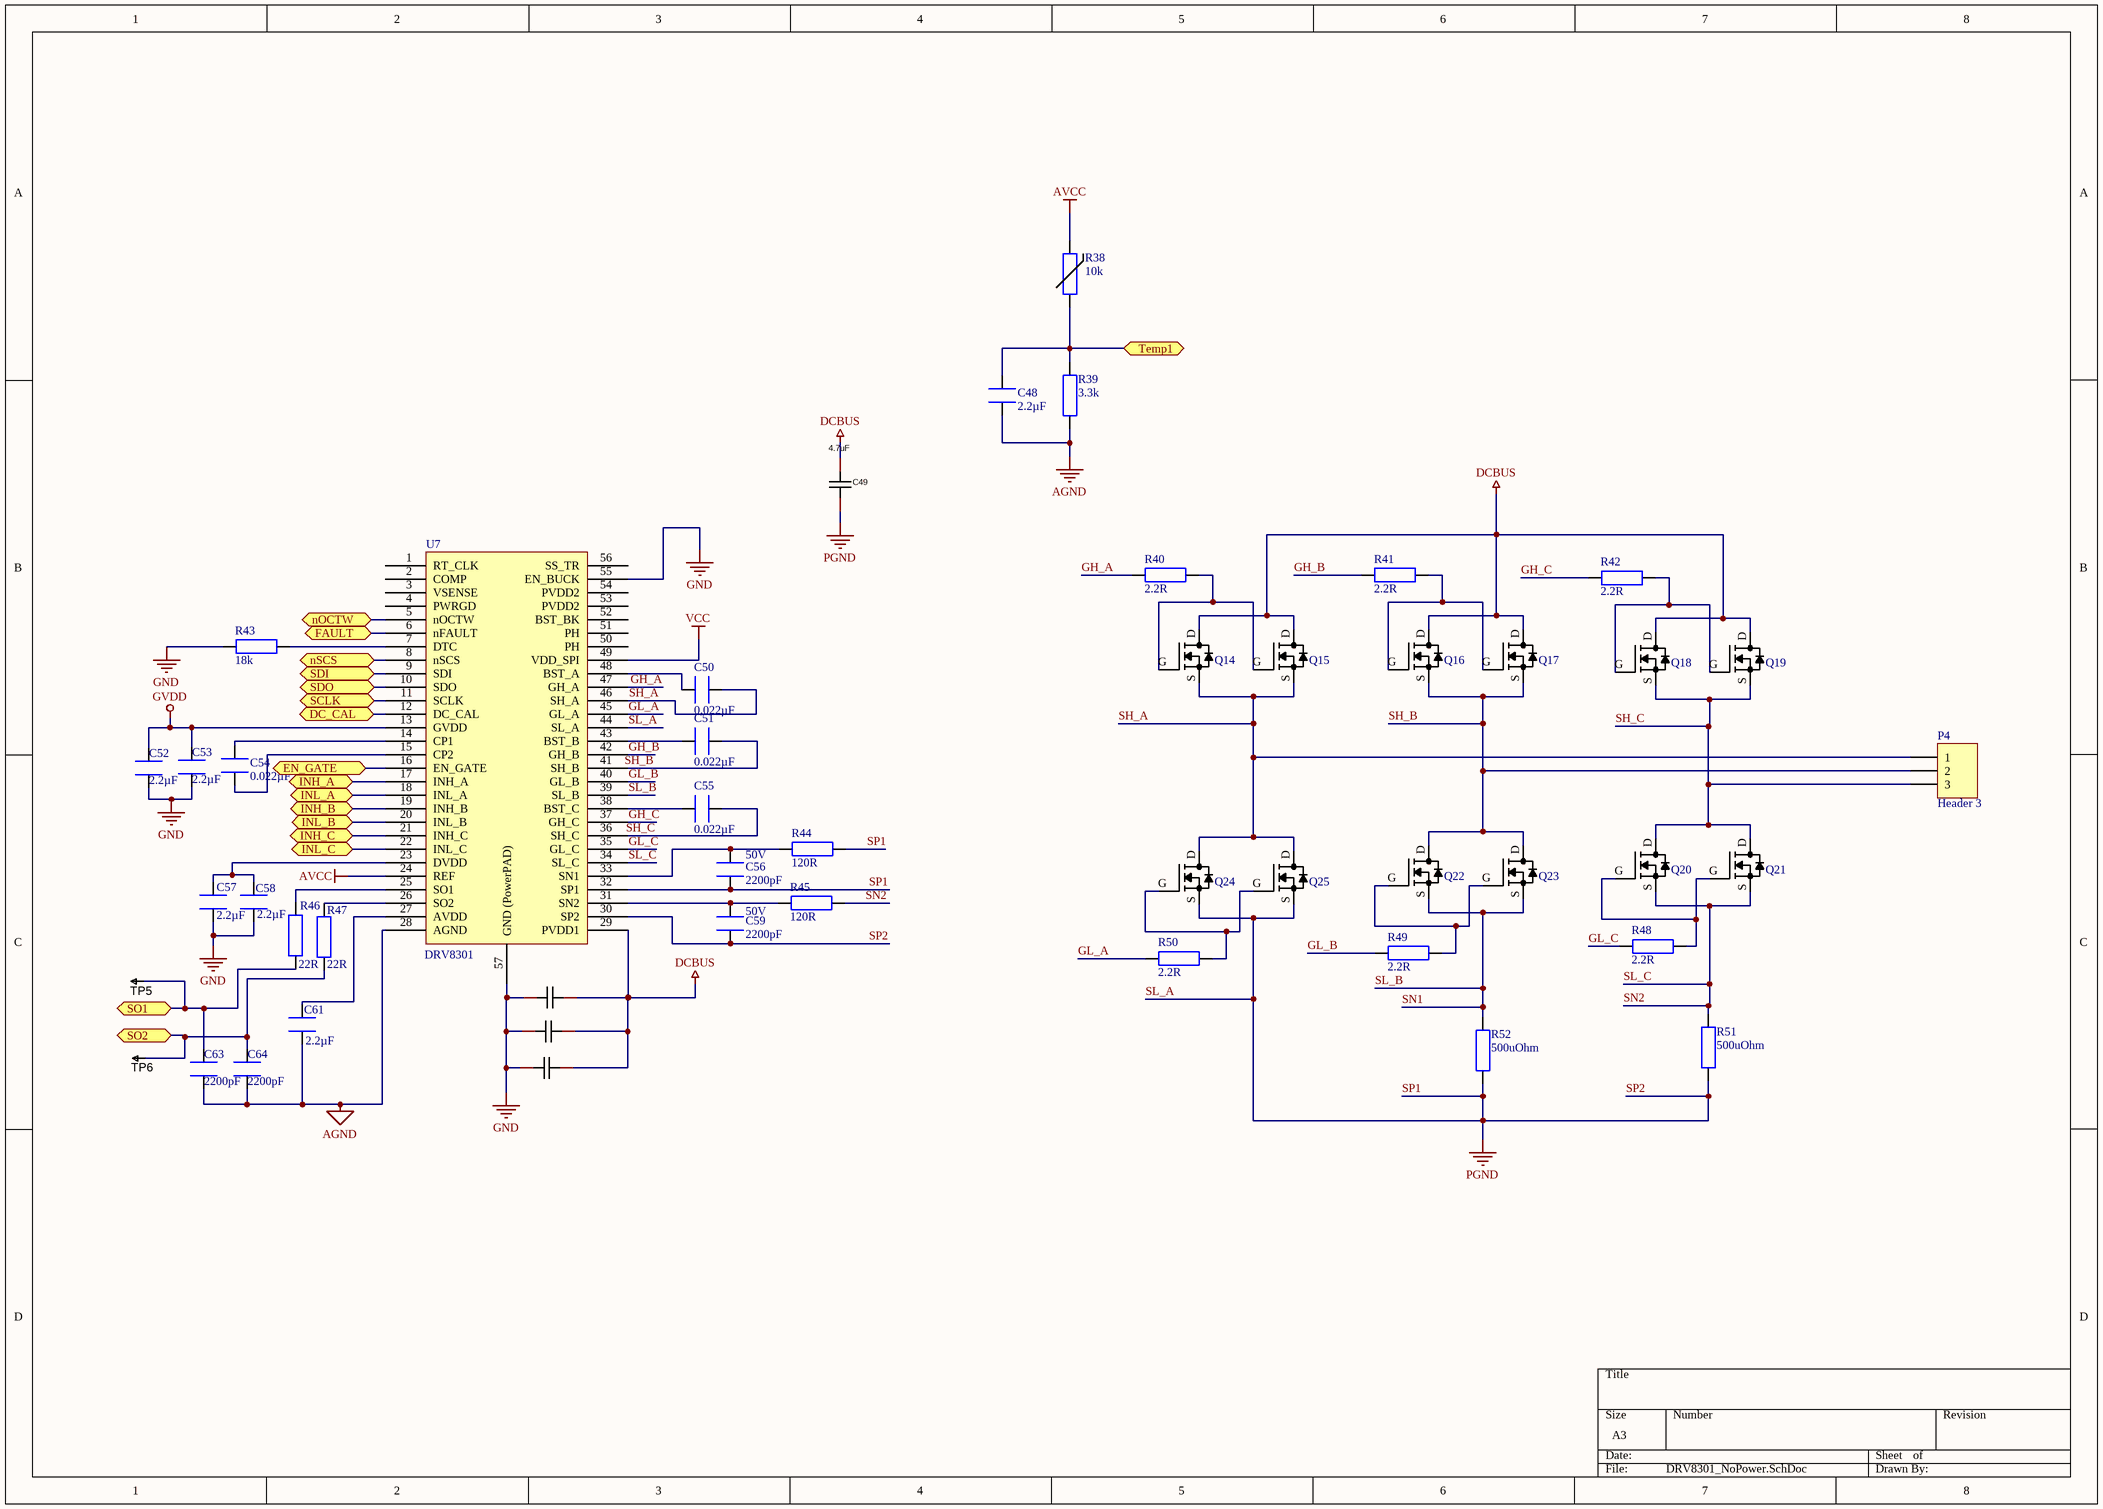
[diagram p3: DRV8301_NoPower.SchDoc]

### Parts
C48  2.2µF  [CAPC1608X09L]
C49  4.7uF  [C1210]
C50  0.022µF  [CAPC1608X09L]
C51  0.022µF  [CAPC1608X09L]
C52  2.2µF  [CAPC1608X09L]
C53  2.2µF  [CAPC1608X09L]
C54  0.022µF  [CAPC1608X09L]
C55  0.022µF  [CAPC1608X09L]
C56  2200pF  Voltage - Rated: 50V  [CAPC1608X09L]
C57  2.2µF  [CAPC1608X09L]
C58  2.2µF  [CAPC1608X09L]
C59  2200pF  Voltage - Rated: 50V  [CAPC1608X09L]
C60  4.7uF  [C1210]  (value not drawn)
C61  2.2µF  [CAPC1608X09L]
C62  4.7uF  [C1210]  (value not drawn)
C63  2200pF  [CAPC1608X09L]
C64  2200pF  [CAPC1608X09L]
C65  4.7uF  [C1210]  (value not drawn)
P4  Header 3  [CONN-TH_MR30-M]
Q14  NTMFS5C628NLT  [SO8FL]  (value not drawn)
Q15  NTMFS5C628NLT  [SO8FL]  (value not drawn)
Q16  NTMFS5C628NLT  [SO8FL]  (value not drawn)
Q17  NTMFS5C628NLT  [SO8FL]  (value not drawn)
Q18  NTMFS5C628NLT  [SO8FL]  (value not drawn)
Q19  NTMFS5C628NLT  [SO8FL]  (value not drawn)
Q20  NTMFS5C628NLT  [SO8FL]  (value not drawn)
Q21  NTMFS5C628NLT  [SO8FL]  (value not drawn)
Q22  NTMFS5C628NLT  [SO8FL]  (value not drawn)
Q23  NTMFS5C628NLT  [SO8FL]  (value not drawn)
Q24  NTMFS5C628NLT  [SO8FL]  (value not drawn)
Q25  NTMFS5C628NLT  [SO8FL]  (value not drawn)
R38  value 10k  [RESC1005X40N]  (hidden comment: NCP15XH103F03RC)
R39  3.3k  [RESC1608X55N]
R40  2.2R  [RESC1608X55N]
R41  2.2R  [RESC1608X55N]
R42  2.2R  [RESC1608X55N]
R43  18k  [RESC1608X55N]
R44  120R  [RESC1608X55N]
R45  120R  [RESC1608X55N]
R46  22R  [RESC1608X55N]
R47  22R  [RESC1608X55N]
R48  2.2R  [RESC1608X55N]
R49  2.2R  [RESC1608X55N]
R50  2.2R  [RESC1608X55N]
R51  value 500uOhm  [RESC6432X09N]  (hidden comment: CSR2512C0R0005F)
R52  value 500uOhm  [RESC6432X09N]  (hidden comment: CSR2512C0R0005F)
TP5  TESTPOINT  [TP-R30]  (value not drawn)  (no BOM)
TP6  TESTPOINT  [TP-R30]  (value not drawn)  (no BOM)
U7  DRV8301  [TSSOP50P810X120_HS-57N]

### Ports
DC_CAL (bidir), EN_GATE (bidir), FAULT (bidir), INH_A (bidir), INH_B (bidir), INH_C (bidir), INL_A (bidir), INL_B (bidir), INL_C (bidir), nOCTW (bidir), nSCS (bidir), SCLK (bidir), SDI (bidir), SDO (bidir), SO1 (bidir), SO2 (bidir), Temp1 (bidir)

### Nets
AGND: C48.1 C52.1 C53.1 C57.2 C58.2 C60.1 C61.1 C62.1 C63.1 C64.1 C65.1 R39.1 R43.2 U7.28(AGND) U7.55(EN_BUCK) U7.57(GND_(PowerPAD))  [also labelled GND]
AVCC: R38.2 U7.24(REF)
DCBUS: C49.2 C60.2 C62.2 C65.2 Q14.D Q15.D Q16.D Q17.D Q18.D Q19.D U7.29(PVDD1)
GVDD: C52.2 C53.2 U7.13(GVDD)
PGND: C49.1 C56.1 C59.1 Q24.S Q25.S R44.1 R51.1 R52.1 U7.30(SP2) U7.32(SP1) U7.44(SL_A)  [also labelled SL_A, SP1, SP2]
VCC: U7.49(VDD_SPI)
EN_GATE: U7.16(EN_GATE) ; port EN_GATE
FAULT: U7.6(nFAULT) ; port FAULT
GH_A: R40.2 U7.47(GH_A)  [project net GH_A_3]
GH_B: R41.2 U7.42(GH_B)  [project net GH_B_3]
GH_C: R42.2 U7.37(GH_C)  [project net GH_C_3]
GL_A: R50.2 U7.45(GL_A)  [project net GL_A_3]
GL_B: R49.2 U7.40(GL_B)  [project net GL_B_3]
GL_C: R48.2 U7.35(GL_C)  [project net GL_C_3]
M0_TEMP: C48.2 R38.1 R39.2 ; port Temp1
M1_AH: U7.17(INH_A) ; port INH_A
M1_AL: U7.18(INL_A) ; port INL_A
M1_BH: U7.19(INH_B) ; port INH_B
M1_BL: U7.20(INL_B) ; port INL_B
M1_CH: U7.21(INH_C) ; port INH_C
M1_CL: U7.22(INL_C) ; port INL_C
M1_nCS: U7.8(nSCS) ; port nSCS
M1_SO1: C63.2 R46.2 TP5.1 ; port SO1
M1_SO2: C64.2 R47.2 TP6.1 ; port SO2
OCTW: U7.5(nOCTW) ; port nOCTW
SH_A: C50.1 P4.1 Q14.S Q15.S Q24.D Q25.D U7.46(SH_A)  [project net SH_A_3]
SH_B: C51.1 P4.2 Q16.S Q17.S Q22.D Q23.D U7.41(SH_B)  [project net SH_B_3]
SH_C: C55.1 P4.3 Q18.S Q19.S Q20.D Q21.D U7.36(SH_C)  [project net SH_C_3]
SL_B: Q22.S Q23.S R52.2 U7.39(SL_B)  [also labelled SN1]  [project net SL_B_3]
SL_C: Q20.S Q21.S R45.1 R51.2 U7.34(SL_C)  [also labelled SN2]  [project net SL_C_3]
SPI_MISO: U7.9(SDI) ; port SDI
SPI_MOSI: U7.10(SDO) ; port SDO
SPI_SCK: U7.11(SCLK) ; port SCLK
NetC50_2: C50.2 U7.48(BST_A)
NetC51_2: C51.2 U7.43(BST_B)
NetC54_1: C54.1 U7.14(CP1)
NetC54_2: C54.2 U7.15(CP2)
NetC55_2: C55.2 U7.38(BST_C)
NetC56_2: C56.2 R44.2 U7.33(SN1)
NetC57_1: C57.1 C58.1 U7.23(DVDD)
NetC59_2: C59.2 R45.2 U7.31(SN2)
NetC61_2: C61.2 U7.27(AVDD)
NetQ14_G: Q14.G Q15.G R40.1
NetQ16_G: Q16.G Q17.G R41.1
NetQ18_G: Q18.G Q19.G R42.1
NetQ20_G: Q20.G Q21.G R48.1
NetQ22_G: Q22.G Q23.G R49.1
NetQ24_G: Q24.G Q25.G R50.1
NetR43_1: R43.1 U7.7(DTC)
NetR46_1: R46.1 U7.25(SO1)
NetR47_1: R47.1 U7.26(SO2)
NetU7_12: U7.12(DC_CAL) ; port DC_CAL

Not connected (* = marked no-connect by the designer): U7 1(RT_CLK) 2(COMP) 3(VSENSE) 4(PWRGD) 50(PH) 51(PH) 52(BST_BK) 53(PVDD2) 54(PVDD2) 56(SS_TR)

### Library data of the parts
C48 C52 C53 C57 C58 C61 = GRM188R61C225KE15D: as C25 on sheet DRV8301_Power; Supplier 1: Digi-Key; Supplier Part Number 1: 490-3296-1-ND; Manufacturer Part Number: GRM188R61C225KE15D; RoHS: RoHS Compliant; Category: Capacitors; Stock 1: 1255740; Pricing 1: 1=0.12, 10=0.08, 50=0.046, 100=0.038, 250=0.032, 500=0.0268, 1000=0.022 (USD); Packaging: Cut Tape (CT); Capacitance: 2.2µF; Voltage - Rated: 16V; Temperature Coefficient: X5R; Mounting Type: Surface Mount, MLCC; Operating Temperature: -55°C ~ 85°C; Applications: General Purpose; Ratings: -; Package / Case: 0603 (1608 Metric); Size / Dimension: 0.063" L x 0.031" W (1.60mm x 0.80mm); Height - Seated (Max): -; Thickness (Max): 0.035" (0.90mm); Lead Spacing: -; Features: -; Lead Style: -; ComponentLink1URL: http://www.murata.com/~/media/webrenewal/support/library/catalog/products/capacitor/mlcc/c02e.pdf; ComponentLink1Description: http://www.murata.com/~/media/webrenewal/support/library/catalog/products/capacitor/mlcc/c02e.pdf
C49 C60 C62 C65 = C1210X7R475K630NT: as C28 on sheet DRV8301_Power; Name: 4.7uF; Symbol: C1210X7R475K630NT; Device: C1210X7R475K630NT; Manufacturer Part: C1210X7R475K630NT; Value: 4.7uF; Supplier Part: C2911397; Supplier Footprint: 1210; JLCPCB Part Class: Extended Part; Datasheet: https://atta.szlcsc.com/upload/public/pdf/source/20210902/8F39E0658D363F48630A7672568BDC14.pdf; Supplier: LCSC; Convert to PCB: yes; LCSC Part Name: 4.7uF 63V; Voltage Rated: 63V
C50 C51 C54 C55 = GRM188R71H223KA01D: as C32 on sheet DRV8301_Power; Supplier 1: Digi-Key; Supplier Part Number 1: 490-1517-2-ND; Manufacturer Part Number: GRM188R71H223KA01D; RoHS: RoHS Compliant; Category: Capacitors; Pricing 1: 4000=0.01518, 8000=0.01386, 12000=0.0132 (USD); Packaging: Tape & Reel (TR); Capacitance: 0.022µF; Voltage - Rated: 50V; Temperature Coefficient: X7R; Mounting Type: Surface Mount, MLCC; Operating Temperature: -55°C ~ 125°C; Applications: General Purpose; Ratings: -; Package / Case: 0603 (1608 Metric); Size / Dimension: 0.063" L x 0.032" W (1.60mm x 0.80mm); Height - Seated (Max): -; Thickness (Max): 0.035" (0.90mm); Lead Spacing: -; Features: -; Lead Style: -; ComponentLink1URL: http://search.murata.co.jp/Ceramy/image/img/A01X/G101/ENG/GRM188R71H223KA01-01.pdf; ComponentLink1Description: http://search.murata.co.jp/Ceramy/image/img/A01X/G101/ENG/GRM188R71H223KA01-01.pdf; Stock: 608000; Part Status: Active; Supplier 2: Digi-Key; Supplier Part Number 2: 490-1517-1-ND; Pricing 2: 1=0.11, 10=0.083, 100=0.0372, 500=0.02656, 1000=0.02087 (USD)
C56 C59 C63 C64 = GRM1885C1H222JA01D: as C38 on sheet DRV8301_Power; Supplier 1: Digi-Key; Supplier Part Number 1: 490-1459-1-ND; RoHS: RoHS Compliant; Category: Capacitors; Stock 1: 850589; Pricing 1: 1=0.11, 10=0.08, 25=0.058, 50=0.0434, 100=0.0355, 250=0.02972, 500=0.02536, 1000=0.01992 (USD); Packaging: Cut Tape (CT); Capacitance: 2200pF; Mounting Type: Surface Mount, MLCC; Operating Temperature: -55°C ~ 125°C; Applications: General Purpose; Ratings: -; Package / Case: 0603 (1608 Metric); Size / Dimension: 0.063" L x 0.031" W (1.60mm x 0.80mm); Height - Seated (Max): -; Thickness (Max): 0.035" (0.90mm); Lead Spacing: -; Features: -; Lead Style: -; ComponentLink1URL: http://www.murata.com/~/media/webrenewal/support/library/catalog/products/capacitor/mlcc/c02e.ashx; ComponentLink1Description: http://www.murata.com/~/media/webrenewal/support/library/catalog/products/capacitor/mlcc/c02e.ashx; Part Status: Active
  C63 C64: Voltage - Rated: 50V
P4 = Header 3: Header, 3-Pin; LatestRevisionDate: 17-Jul-2002; LatestRevisionNote: Re-released for DXP Platform.; Publisher: Altium Limited
Q14-Q25 = NTMFS5C628NLT: as Q2 on sheet DRV8301_Power; Supplier 1: Digi-Key; Supplier Part Number 1: NTMFS5C628NLT1GOSCT-ND; RoHS: RoHS Compliant; Category: Discrete Semiconductor Products; Stock: 1490; Pricing 1: 1=1.8, 10=1.627, 100=1.3078, 500=1.01716 (USD); Packaging: Cut Tape (CT); Part Status: Active; Technology: MOSFET (Metal Oxide); Current - Continuous Drain (Id) @ 25°C: -; FET Feature: -; Operating Temperature: -55°C ~ 175°C (TJ); Mounting Type: Surface Mount; Supplier Device Package: 5-DFN (5x6) (8-SOFL); Package / Case: 8-PowerTDFN; ComponentLink1URL: http://www.onsemi.com/pub/Collateral/NTMFS5C628NL-D.PDF; ComponentLink1Description: http://www.onsemi.com/pub/Collateral/NTMFS5C628NL-D.PDF; Supplier 2: Digi-Key; Supplier Part Number 2: NTMFS5C628NLT1GOSTR-ND; Pricing 2: 1500=0.81823 (USD)
R38 = NCP15XH103F03RC: THERMISTOR 10K OHM NTC 0402 SMD
R39 = RC0603FR-073K3L: as R20 on sheet DRV8301_Power; Supplier 1: Digi-Key; Supplier Part Number 1: 311-3.30KHRCT-ND; Manufacturer Part Number: RC0603FR-073K3L; RoHS: RoHS Compliant; Category: Resistors; Stock 1: 420019; Pricing 1: 1=0.1, 10=0.014, 25=0.01, 100=0.0057, 250=0.00436, 500=0.00348, 1000=0.00257, 2500=0.00223 (USD); Packaging: Cut Tape (CT); Resistance (Ohms): 3.3k; Tolerance: ±1%; Composition: Thick Film; Features: Moisture Resistant; Operating Temperature: -55°C ~ 155°C; Package / Case: 0603 (1608 Metric); Supplier Device Package: 0603; Size / Dimension: 0.063" L x 0.031" W (1.60mm x 0.80mm); Height: 0.022" (0.55mm); Number of Terminations: 2; ComponentLink1URL: http://www.yageo.com/documents/recent/PYu-RC_Group_51_RoHS_L_04.pdf; ComponentLink1Description: http://www.yageo.com/documents/recent/PYu-RC_Group_51_RoHS_L_04.pdf
R40-R42 R48-R50 = RC0603FR-072R2L: as R24 on sheet DRV8301_Power; Supplier 1: Digi-Key; Supplier Part Number 1: 311-2.2HRCT-ND; Manufacturer Part Number: RC0603FR-072R2L; RoHS: RoHS Compliant; Category: Resistors; Stock 1: 16531; Pricing 1: 1=0.1, 10=0.02, 25=0.0144, 100=0.0082, 250=0.00624, 500=0.00498, 1000=0.00367, 2500=0.00319 (USD); Packaging: Cut Tape (CT); Tolerance: ±1%; Composition: Thick Film; Features: Moisture Resistant; Operating Temperature: -55°C ~ 155°C; Package / Case: 0603 (1608 Metric); Supplier Device Package: 0603; Size / Dimension: 0.063" L x 0.031" W (1.60mm x 0.80mm); Height: 0.022" (0.55mm); Number of Terminations: 2; ComponentLink1URL: http://www.yageo.com/documents/recent/PYu-RC_Group_51_RoHS_L_04.pdf; ComponentLink1Description: http://www.yageo.com/documents/recent/PYu-RC_Group_51_RoHS_L_04.pdf
R43 = RC0603FR-0718KL: as R22 on sheet DRV8301_Power; Supplier 1: Digi-Key; Supplier Part Number 1: 311-18.0KHRCT-ND; Manufacturer Part Number: RC0603FR-0718KL; RoHS: RoHS Compliant; Category: Resistors; Stock 1: 0; Pricing 1: 1=0.1, 10=0.014, 25=0.01, 100=0.0057, 250=0.00436, 500=0.00348, 1000=0.00257, 2500=0.00223 (USD); Packaging: Cut Tape (CT); Resistance (Ohms): 18k; Tolerance: ±1%; Composition: Thick Film; Features: Moisture Resistant; Operating Temperature: -55°C ~ 155°C; Package / Case: 0603 (1608 Metric); Supplier Device Package: 0603; Size / Dimension: 0.063" L x 0.031" W (1.60mm x 0.80mm); Height: 0.022" (0.55mm); Number of Terminations: 2; ComponentLink1URL: http://www.yageo.com/documents/recent/PYu-RC_Group_51_RoHS_L_04.pdf; ComponentLink1Description: http://www.yageo.com/documents/recent/PYu-RC_Group_51_RoHS_L_04.pdf
R44 R45 = RC0603FR-07120RL: as R29 on sheet DRV8301_Power; Supplier 1: Digi-Key; Supplier Part Number 1: 311-120HRCT-ND; Manufacturer Part Number: RC0603FR-07120RL; RoHS: RoHS Compliant; Category: Resistors; Stock 1: 1545282; Pricing 1: 1=0.1, 10=0.014, 25=0.01, 100=0.0057, 250=0.00436, 500=0.00348, 1000=0.00257, 2500=0.00223 (USD); Packaging: Cut Tape (CT); Tolerance: ±1%; Composition: Thick Film; Features: Moisture Resistant; Operating Temperature: -55°C ~ 155°C; Package / Case: 0603 (1608 Metric); Supplier Device Package: 0603; Size / Dimension: 0.063" L x 0.031" W (1.60mm x 0.80mm); Height: 0.022" (0.55mm); Number of Terminations: 2; ComponentLink1URL: http://www.yageo.com/documents/recent/PYu-RC_Group_51_RoHS_L_04.pdf; ComponentLink1Description: http://www.yageo.com/documents/recent/PYu-RC_Group_51_RoHS_L_04.pdf
R46 R47 = RC0603FR-0722RL: as R31 on sheet DRV8301_Power; Supplier 1: Digi-Key; Supplier Part Number 1: 311-22.0HRCT-ND; Manufacturer Part Number: RC0603FR-0722RL; RoHS: RoHS Compliant; Category: Resistors; Stock 1: 575303; Pricing 1: 1=0.1, 10=0.014, 25=0.01, 100=0.0057, 250=0.00436, 500=0.00348, 1000=0.00257, 2500=0.00223 (USD); Packaging: Cut Tape (CT); Tolerance: ±1%; Composition: Thick Film; Features: Moisture Resistant; Operating Temperature: -55°C ~ 155°C; Package / Case: 0603 (1608 Metric); Supplier Device Package: 0603; Size / Dimension: 0.063" L x 0.031" W (1.60mm x 0.80mm); Height: 0.022" (0.55mm); Number of Terminations: 2; ComponentLink1URL: http://www.yageo.com/documents/recent/PYu-RC_Group_51_RoHS_L_04.pdf; ComponentLink1Description: http://www.yageo.com/documents/recent/PYu-RC_Group_51_RoHS_L_04.pdf
R51 R52 = CSR2512C0R0005F: as R36 on sheet DRV8301_Power; Supplier 1: Digi-Key; Supplier Part Number 1: 696-1183-2-ND; RoHS: RoHS Compliant; Category: Resistors; Stock: 2000; Pricing 1: 2000=0.19817, 6000=0.1937, 10000=0.187, 50000=0.18148 (USD); Packaging: Tape & Reel (TR); Part Status: Active; Tolerance: ±1%; Power (Watts): 3W; Composition: Metal Element; Features: Current Sense; Operating Temperature: -55°C ~ 170°C; Package / Case: 2512 (6432 Metric); Supplier Device Package: 2512; Size / Dimension: 0.250" L x 0.118" W (6.35mm x 3.00mm); Height - Seated (Max): 0.057" (1.45mm); Failure Rate: -; ComponentLink1URL: http://riedon.com/media/pdf/CSR.pdf; ComponentLink1Description: http://riedon.com/media/pdf/CSR.pdf; Supplier 2: Digi-Key; Supplier Part Number 2: 696-1183-1-ND; Pricing 2: 1=0.69, 10=0.574, 25=0.4916, 50=0.4426, 100=0.3852, 250=0.3442, 500=0.27864, 1000=0.22536 (USD); Manufacturer Part Number: CSR2512C0R0005F
TP5 TP6 = TESTPOINT: SMD test pin
U7 = DRV8301: MOTOR DRIVER, 3PH, 56HTSSOP

## Nets that join several sheets
+5: STM32F405 (7 pins), DRV8301_Power (C31.1 L1.2 R22.2)
AGND: STM32F405 (42 pins), AuxHalf (5 pins), DRV8301_Power (23 pins), DRV8301_NoPower (16 pins)
AVCC: STM32F405 (C24.2 TP1.1 U4.4 U4.5), AuxHalf (R53.2), DRV8301_Power (R19.2 U6.24), DRV8301_NoPower (R38.2 U7.24)
DCBUS: STM32F405 (10 pins), AuxHalf (Q26.D Q27.D), DRV8301_Power (14 pins), DRV8301_NoPower (11 pins)
GVDD: DRV8301_Power (C34.2 C35.2 U6.13), DRV8301_NoPower (C52.2 C53.2 U7.13)
PGND: STM32F405 (9 pins), AuxHalf (C68.1 U8.4 U9.1), DRV8301_Power (9 pins), DRV8301_NoPower (11 pins)
VCC: STM32F405 (31 pins), AuxHalf (C68.2 D3.A U8.1), DRV8301_Power (U6.49), DRV8301_NoPower (U7.49)
AUX_H: STM32F405 (U3.30), AuxHalf (U8.2)
AUX_L: STM32F405 (U3.29), AuxHalf (U8.3)
AUX_TEMP: STM32F405 (U3.21), AuxHalf (C66.2 R53.1 R55.2)
EN_GATE: STM32F405 (U3.33), DRV8301_Power (U6.16), DRV8301_NoPower (U7.16)
FAULT: STM32F405 (U3.54), DRV8301_Power (U6.6), DRV8301_NoPower (U7.6)
M0_AH: STM32F405 (U3.41), DRV8301_Power (U6.17)
M0_AL: STM32F405 (U3.34), DRV8301_Power (U6.18)
M0_BH: STM32F405 (U3.42), DRV8301_Power (U6.19)
M0_BL: STM32F405 (U3.35), DRV8301_Power (U6.20)
M0_CH: STM32F405 (U3.43), DRV8301_Power (U6.21)
M0_CL: STM32F405 (U3.36), DRV8301_Power (U6.22)
M0_nCS: STM32F405 (U3.2), DRV8301_Power (U6.8)
M0_SO1: STM32F405 (U3.8), DRV8301_Power (C45.2 R31.2 TP3.1)
M0_SO2: STM32F405 (U3.9), DRV8301_Power (C46.2 R32.2 TP4.1)
M0_TEMP: DRV8301_Power (C25.2 R19.1 R20.2), DRV8301_NoPower (C48.2 R38.1 R39.2)
M1_AH: STM32F405 (U3.37), DRV8301_NoPower (U7.17)
M1_AL: STM32F405 (U3.23), DRV8301_NoPower (U7.18)
M1_BH: STM32F405 (U3.38), DRV8301_NoPower (U7.19)
M1_BL: STM32F405 (U3.26), DRV8301_NoPower (U7.20)
M1_CH: STM32F405 (U3.39), DRV8301_NoPower (U7.21)
M1_CL: STM32F405 (U3.27), DRV8301_NoPower (U7.22)
M1_nCS: STM32F405 (U3.3), DRV8301_NoPower (U7.8)
M1_SO1: STM32F405 (U3.11), DRV8301_NoPower (C63.2 R46.2 TP5.1)
M1_SO2: STM32F405 (U3.10), DRV8301_NoPower (C64.2 R47.2 TP6.1)
OCTW: DRV8301_Power (U6.5), DRV8301_NoPower (U7.5)
SPI_MISO: STM32F405 (CN3.3 CN4.3 U3.52), DRV8301_Power (U6.9), DRV8301_NoPower (U7.9)
SPI_MOSI: STM32F405 (CN3.2 CN4.2 U3.53), DRV8301_Power (U6.10), DRV8301_NoPower (U7.10)
SPI_SCK: STM32F405 (CN3.4 CN4.4 U3.51), DRV8301_Power (U6.11), DRV8301_NoPower (U7.11)